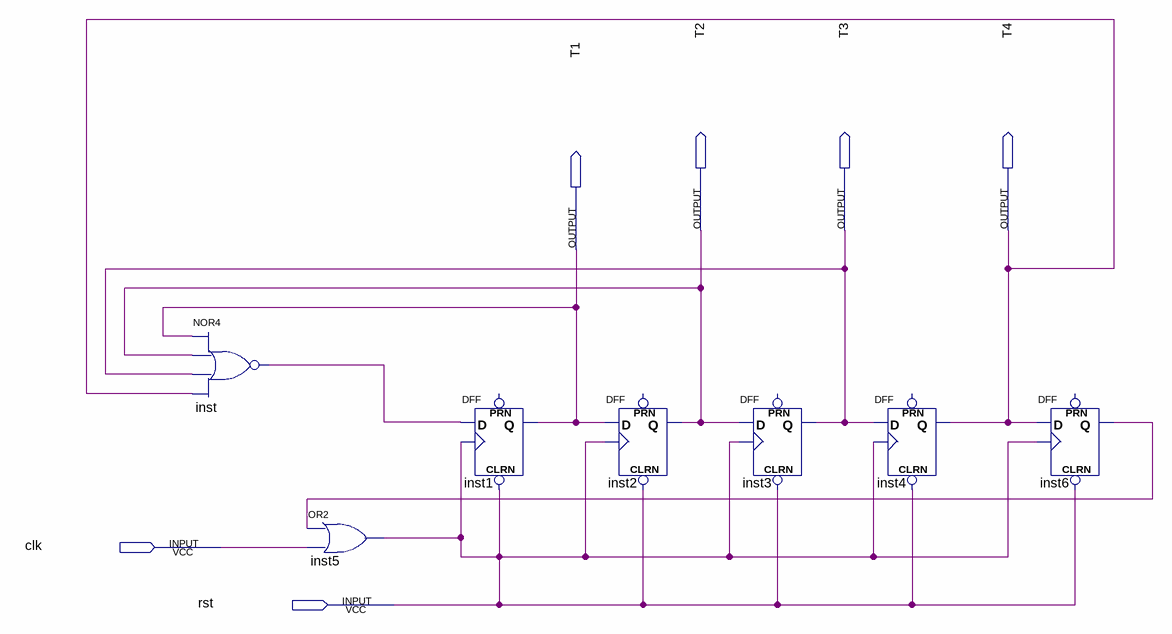
[diagram p0: schematic sheet]
// Quartus schematic step3.bdf as structural Verilog: 7 symbols, 6 pins
module step3 (
  input  clk,
  input  rst,
  output T2,
  output T3,
  output T4,
  output T1
);

  wire inst6_q, inst_out;

  nor inst (inst_out, T1, T2, T3, T4);
  or inst5 (rst, inst6_q, clk);
  DFF inst1 (.CLRN(rst), .CLK(rst), .D(inst_out), .Q(T1));  // open: PRN
  DFF inst2 (.CLRN(rst), .CLK(rst), .D(T1), .Q(T2));  // open: PRN
  DFF inst3 (.CLRN(rst), .CLK(rst), .D(T2), .Q(T3));  // open: PRN
  DFF inst4 (.CLRN(rst), .CLK(rst), .D(T3), .Q(T4));  // open: PRN
  DFF inst6 (.CLRN(rst), .CLK(rst), .D(T4), .Q(inst6_q));  // open: PRN
endmodule
